# Altium project Sensor_Box_CAN_Switch.PrjPCB
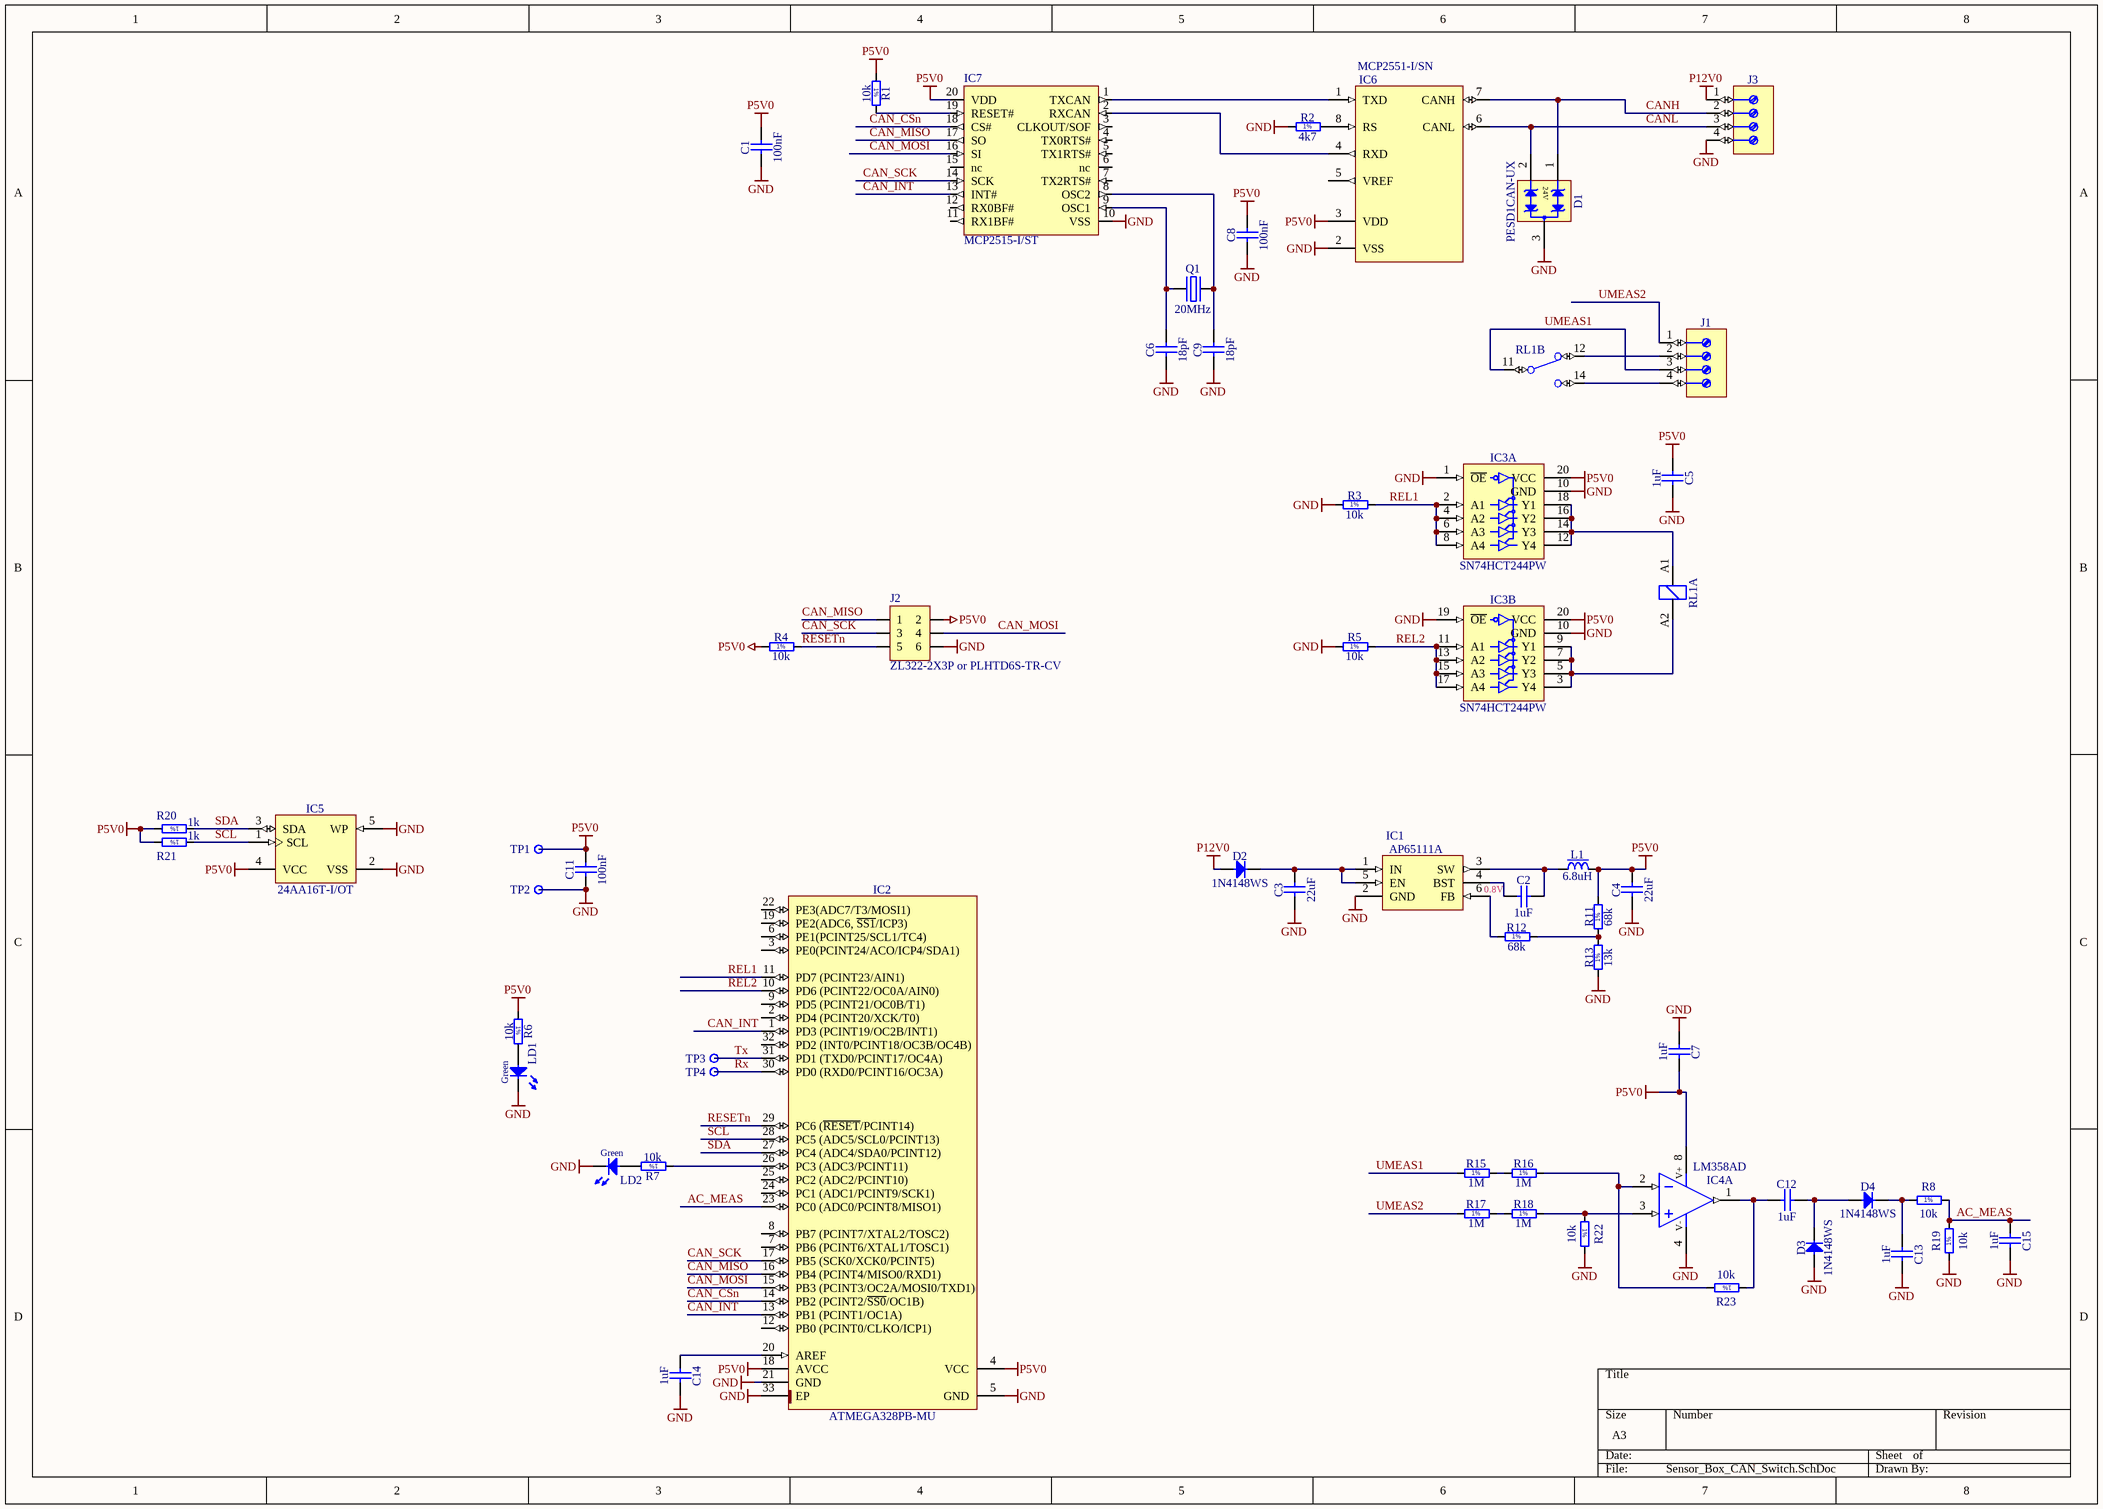
[diagram p0: Sensor_Box_CAN_Switch.SchDoc]
1 sheet, 57 parts. Net scope: global (net labels, ports and power ports of the same name join across sheets).
Board file: Sensor_Box_CAN_Switch.PCBDOC

## Sheet Sensor_Box_CAN_Switch.SchDoc
size A3

### Parts
C1  100nF  [CAPC1005X55N]
C2  1uF  [CAPC1608X87N]
C3  22uF  [CAPC1709X100N]
C4  22uF  [CAPC1709X100N]
C5  1uF  [CAPC1005X55N]
C6  18pF  [CAPC1005X55N]
C7  1uF  [CAPC1005X55N]
C8  100nF  [CAPC1005X55N]
C9  18pF  [CAPC1005X55N]
C11  100nF  [CAPC1005X55N]
C12  1uF  [CAPC1005X55N]
C13  1uF  [CAPC1005X55N]
C14  1uF  [CAPC1005X55N]
C15  1uF  [CAPC1005X55N]
D1  PESD1CAN-UX  [SOT95P237X112-3N]
D2  1N4148WS  [SODFL2512X100N]
D3  1N4148WS  [SODFL2512X100N]
D4  1N4148WS  [SODFL2512X100N]
IC1  AP65111A  [SOT95P285X110-6N]
IC2  ATMEGA328PB-MU  [QFN50P500X500X100-33N-S325]
IC3  SN74HCT244PW  [SOP65P640X120-20N]  (parts A,B of 2)
IC4  LM358AD  [SOIC127P600X175-8N]  (part A of 2)
IC5  24AA16T-I/OT  [SOT95P280X145-5N]
IC6  MCP2551-I/SN  [SOIC127P600X175-8N]
IC7  MCP2515-I/ST  [SOP65P640X110-20N]
J1  (no value)  [TYCO_282836-4]
J2  ZL322-2X3P or PLHTD6S-TR-CV  [ZL322-2X3P]
J3  (no value)  [PHOENIX_1725672]
L1  6.8uH  [IND_WALSIN_WLPN3030]
LD1  Green  [LED_KINGBRIGHT_KPH-1608CGCK]
LD2  Green  [LED_KINGBRIGHT_KPH-1608CGCK]
Q1  20MHz  [XTAL1160X490X430]
R1  10k  [RESC1005X40N]
R2  4k7  [RESC1005X40N]
R3  10k  [RESC1005X40N]
R4  10k  [RESC1005X40N]
R5  10k  [RESC1005X40N]
R6  10k  [RESC1005X40N]
R7  10k  [RESC1005X40N]
R8  10k  [RESC1005X40N]
R11  68k  [RESC1005X40N]
R12  68k  [RESC1005X40N]
R13  13k  [RESC1005X40N]
R15  1M  [RESC3216X65N]
R16  1M  [RESC3216X65N]
R17  1M  [RESC3216X65N]
R18  1M  [RESC3216X65N]
R19  10k  [RESC1005X40N]
R20  1k  [RESC1005X40N]
R21  1k  [RESC1005X40N]
R22  10k  [RESC1005X40N]
R23  10k  [RESC1005X40N]
RL1  REL_TYCO_SCHRACK_PE014F05  [REL_TYCO_SCHRACK_PE]  (value not drawn)  (parts A,B of 2)
TP1  Test Point  [TPS127]  (value not drawn)
TP2  Test Point  [TPS127]  (value not drawn)
TP3  Test Point  [TPS127]  (value not drawn)
TP4  Test Point  [TPS127]  (value not drawn)

### Nets
GND: C1.1 C3.1 C4.1 C5.2 C6.1 C7.1 C8.1 C9.1 C11.1 C13.2 C14.2 C15.2 D1.3(GND) D3.2(A) IC1.2(GND) IC2.5(GND) IC2.21(GND) IC2.33(EP) IC3.1(~{OE}) IC3.10(GND) IC3.19(~{OE}) IC4.4(V-) IC5.2(VSS) IC5.5(WP) IC6.2(VSS) IC7.10(VSS) J2.6 J3.4 LD1.1(C) LD2.1(C) R2.1 R3.1 R5.1 R13.1 R19.1 R22.2 TP2.1
P5V0: C1.2 C4.2 C5.1 C7.2 C8.2 C11.2 IC2.4(VCC) IC2.18(AVCC) IC3.20(VCC) IC4.8(V+) IC5.4(VCC) IC6.3(VDD) IC7.20(VDD) J2.2 L1.2 R1.1 R4.1 R6.1 R11.2 R20.2 R21.2 TP1.1
P12V0: D2.2(A) J3.1
AC_MEAS: C15.1 IC2.23(PC0_(ADC0/PCINT8/MISO1)) R8.2 R19.2
CAN_CSn: IC2.14(PB2_(PCINT2/~{SS0}/OC1B)) IC7.18(CS#)
CAN_INT: IC2.1(PD3_(PCINT19/OC2B/INT1)) IC2.13(PB1_(PCINT1/OC1A)) IC7.13(INT#)
CAN_MISO: IC2.16(PB4_(PCINT4/MISO0/RXD1)) IC7.17(SO) J2.1
CAN_MOSI: IC2.15(PB3_(PCINT3/OC2A/MOSI0/TXD1)) IC7.16(SI) J2.4
CAN_SCK: IC2.17(PB5_(SCK0/XCK0/PCINT5)) IC7.14(SCK) J2.3
CANH: D1.1(I/O1) IC6.7(CANH) J3.2
CANL: D1.2(I/O2) IC6.6(CANL) J3.3
REL1: IC2.11(PD7_(PCINT23/AIN1)) IC3.2(A1) IC3.4(A2) IC3.6(A3) IC3.8(A4) R3.2
REL2: IC2.10(PD6_(PCINT22/OC0A/AIN0)) IC3.11(A1) IC3.13(A2) IC3.15(A3) IC3.17(A4) R5.2
RESETn: IC2.29(PC6_(~{RESET}/PCINT14)) J2.5 R4.2
Rx: IC2.30(PD0_(RXD0/PCINT16/OC3A)) TP4.1
SCL: IC2.28(PC5_(ADC5/SCL0/PCINT13)) IC5.1(SCL) R21.1
SDA: IC2.27(PC4_(ADC4/SDA0/PCINT12)) IC5.3(SDA) R20.1
Tx: IC2.31(PD1_(TXD0/PCINT17/OC4A)) TP3.1
UMEAS1: J1.3 R15.1 RL1.11(C)
UMEAS2: J1.1 R17.1
NetC2_1: C2.1 IC1.4(BST)
NetC2_2: C2.2 IC1.3(SW) L1.1
NetC3_2: C3.2 D2.1(C) IC1.1(IN) IC1.5(EN)
NetC6_2: C6.2 IC7.9(OSC1) Q1.1(OSC1)
NetC9_2: C9.2 IC7.8(OSC2) Q1.2(OSC2)
NetC12_1: C12.1 IC4.1(OUT) R23.1
NetC12_2: C12.2 D3.1(C) D4.2(A)
NetC13_1: C13.1 D4.1(C) R8.1
NetC14_1: C14.1 IC2.20(AREF)
NetIC1_6: IC1.6(FB) R12.1
NetIC2_26: IC2.26(PC3_(ADC3/PCINT11)) R7.1
NetIC3_3: IC3.3(Y4) IC3.5(Y3) IC3.7(Y2) IC3.9(Y1) RL1.A2
NetIC3_12: IC3.12(Y4) IC3.14(Y3) IC3.16(Y2) IC3.18(Y1) RL1.A1
NetIC4_2: IC4.2(IN-) R16.2 R23.2
NetIC4_3: IC4.3(IN+) R18.2 R22.1
NetIC6_1: IC6.1(TXD) IC7.1(TXCAN)
NetIC6_4: IC6.4(RXD) IC7.2(RXCAN)
NetIC6_8: IC6.8(RS) R2.2
NetIC7_19: IC7.19(RESET#) R1.2
NetJ1_2: J1.2 RL1.12(NC)
NetJ1_4: J1.4 RL1.14(NO)
NetLD1_2: LD1.2(A) R6.2
NetLD2_2: LD2.2(A) R7.2
NetR11_1: R11.1 R12.2 R13.2
NetR15_2: R15.2 R16.1
NetR17_2: R17.2 R18.1

Not connected (* = marked no-connect by the designer): IC2 2(PD4_(PCINT20/XCK/T0)) 3(PE0(PCINT24/ACO/ICP4/SDA1)) 6(PE1(PCINT25/SCL1/TC4)) 7(PB6_(PCINT6/XTAL1/TOSC1)) 8(PB7_(PCINT7/XTAL2/TOSC2)) 9(PD5_(PCINT21/OC0B/T1)) 12(PB0_(PCINT0/CLKO/ICP1)) 19(PE2(ADC6,_~{SS1}/ICP3)) 22(PE3(ADC7/T3/MOSI1)) 24(PC1_(ADC1/PCINT9/SCK1)) 25(PC2_(ADC2/PCINT10)) 32(PD2_(INT0/PCINT18/OC3B/OC4B)); IC6 5(VREF); IC7 3(CLKOUT/SOF) 4(TX0RTS#) 5(TX1RTS#) 6(nc) 7(TX2RTS#) 11(RX1BF#) 12(RX0BF#) 15(nc)

### Notes on the sheet
- 0.8V
- (in symbol R0402_1K_1%_0.0625W_100PPM) 1%
- (in symbol R0402_4K7_1%_0.0625W_100PPM) 1%
- (in symbol R0402_10K_1%_0.0625W_100PPM) 1%
- (in symbol R0402_13K_1%_0.0625W_100PPM) 1%
- (in symbol R0402_68K_1%_0.0625W_100PPM) 1%
- (in symbol R1206_1M_1%_0.25W_100PPM) 1%

### Library data of the parts
C1 C8 C11 = CC0402_100NF_16V_10%_X5R: Non-polarised capacitor; Part Description: SMD Multilayer Chip Ceramic Capacitor; Manufacturer: GENERIC; Manufacturer1 Part Number: GRM155R61C104KA88D; Voltage: 16V; TC: X5R; Tolerance: ±10%; Part Number: CC0402_100NF_16V_10%_X5R; Component Kind: Standard; Component Type: Standard; Pin Count: 2; Value: 100nF; Status: None; Manufacturer Part Number: CC0402_100NF_16V_10%_X5R; Case: 0402; Mounted: Yes; Socket: No; SMD: Yes; Sense: No; Manufacturer1 Example: MURATA; Manufacturer1 ComponentHeight: 0.55mm; HelpURL: \\cern.ch\dfs\Applications\Altium\Datasheets\CC0402_X5R_MURATA_GRM.pdf; Author: CERN DEM JLC; CreateDate: 10.12.2013; LatestRevisionDate: 10.12.2013
C2 = CC0603_1UF_16V_10%_X7R: Non-polarised capacitor; Part Description: SMD Multilayer Chip Ceramic Capacitor; Manufacturer: GENERIC; Manufacturer1 Part Number: 223878615663; Voltage: 16V; TC: X7R; Tolerance: ±10%; Part Number: CC0603_1UF_16V_10%_X7R; Component Kind: Standard; Component Type: Standard; Pin Count: 2; Value: 1uF; Status: None; Manufacturer Part Number: CC0603_1uF_16V_10%_X7R; Case: 0603; Mounted: Yes; Socket: No; SMD: Yes; Sense: No; Manufacturer1 Example: YAGEO PHYCOMP; Manufacturer1 ComponentHeight: 0.9mm; HelpURL: \\cern.ch\dfs\Applications\Altium\Datasheets\CC0603_X7R_PHYCOMP.pdf; Author: CERN DEM JLC; CreateDate: 03.12.2007; LatestRevisionDate: 17.04.2015
C3 C4 = CC0603_22UF_6.3V_20%_X5R: Non-polarised capacitor; Part Description: SMD Multilayer Chip Ceramic Capacitor; Manufacturer: GENERIC; Manufacturer1 Part Number: C1608X5R0J226M080AC; Voltage: 6.3V; TC: X5R; Tolerance: ±20%; Part Number: CC0603_22UF_6.3V_20%_X5R; Component Kind: Standard; Component Type: Standard; Pin Count: 2; Value: 22uF; Status: None; Manufacturer Part Number: CC0603_22UF_6.3V_20%_X5R; Case: 0603; Mounted: Yes; Socket: No; SMD: Yes; Sense: No; Manufacturer1 Example: TDK; Manufacturer1 ComponentHeight: 1mm; HelpURL: \\cern.ch\dfs\Applications\Altium\Datasheets\CC0603_X5R_TDK_C.pdf; Author: CERN DEM JLC; CreateDate: 16.12.2013; LatestRevisionDate: 13.09.2016
C5 C7 C12-C15 = CC0402_1UF_16V_10%_X5R: Non-polarised capacitor; Part Description: SMD Multilayer Chip Ceramic Capacitor; Manufacturer: GENERIC; Manufacturer1 Part Number: C1005X5R1C105KT; Voltage: 16V; TC: X5R; Tolerance: ±10%; Part Number: CC0402_1UF_16V_10%_X5R; Component Kind: Standard; Component Type: Standard; Pin Count: 2; Value: 1uF; Status: Preferred; Manufacturer Part Number: CC0402_1UF_16V_10%_X5R; Case: 0402; Mounted: Yes; Socket: No; SMD: Yes; Sense: No; Manufacturer1 Example: TDK; Manufacturer1 ComponentHeight: 0.55mm; HelpURL: \\cern.ch\dfs\Applications\Altium\Datasheets\CC0402_X5R_TDK_C.pdf; Author: CERN DEM JLC; CreateDate: 25.10.2012; LatestRevisionDate: 25.10.2012
C6 C9 = CC0402_18PF_50V_5%_C0G: Non-polarised capacitor; Part Description: SMD Multilayer Chip Ceramic Capacitor; Manufacturer: GENERIC; Manufacturer1 Part Number: C0402C180J5GACTU; Voltage: 50V; TC: C0G/NP0; Tolerance: ±5%; Part Number: CC0402_18PF_50V_5%_C0G; Component Kind: Standard; Component Type: Standard; Pin Count: 2; Value: 18pF; Status: Preferred; Manufacturer Part Number: CC0402_18PF_50V_5%_C0G; Case: 0402; Mounted: Yes; Socket: No; SMD: Yes; Sense: No; Manufacturer1 Example: KEMET; Manufacturer1 ComponentHeight: 0.55mm; HelpURL: \\cern.ch\dfs\Applications\Altium\Datasheets\CC0805_C0G_KEMET_(Commercial Grade).pdf; Author: CERN DEM JLC; CreateDate: 04.10.2016; LatestRevisionDate: 04.10.2016
D1 = D_TVS_PESD1CAN: TVS Diode for CAN; Manufacturer: Nexperia; Voltage: 24V; Power: 400W; PressFit: No; Bonding: No; Part Number: PESD1CAN-UX; Component Kind: Standard; Component Type: Standard; Device: PESD1CAN-UX; PackageDescription: SOT, 0.95mm, pitch; 3 pin,1.30mm W X 2.92mm L X 1.12mm H body, IPC Medium Density; Part Description: TVS Diode for CAN; Manufacturer Part Number: PESD1CAN-UX; Pin Count: 3; Case: SOT-23; Mounted: Yes; Socket: No; SMD: Yes; Sense: No; ComponentHeight: 1.12mm; HelpURL: \\cern.ch\dfs\Applications\Altium\Datasheets\SM712.TCT.pdf; Author: CERN DEM JLC; CreateDate: 03.09.2014; LatestRevisionDate: 13.01.2015
D2-D4 = 1N4148WS: Diode; Part Description: Small Signal Diodes; Manufacturer: FAIRCHILD SEMICONDUCTOR; Voltage: 75V; Power: 150mA; PressFit: No; Bonding: No; Part Number: 1N4148WS; Component Kind: Standard; Component Type: Standard; Device: 1N4148WS; PackageDescription: SODFL Diode; 1.70mm W X 1.25mm L X 1.00mm H body, IPC Medium Density; Manufacturer Part Number: 1N4148WS; Pin Count: 2; Case: SOD-323F; Mounted: Yes; Socket: No; SMD: Yes; Sense: No; ComponentHeight: 1mm; HelpURL: \\cern.ch\dfs\Applications\Altium\Datasheets\1N4148WS.pdf; Author: CERN DEM JLC; CreateDate: 12.05.2011; LatestRevisionDate: 12.05.2011
IC1 = PM_AP65111A: LIGHT LOAD IMPROVED 1.5A SYNCH DC/DC BUCK CONVERTER; Manufacturer: DIODES INCORPORATED; PressFit: No; Bonding: No; Part Number: AP65111A; Component Kind: Standard; Component Type: Standard; Device: AP65111A; PackageDescription: SOT23, 0.95mm pitch; 6 pin, 1.6mm W X 3.0mm L X 1.45mm H body, IPC Medium Density; Part Description: LIGHT LOAD IMPROVED 1.5A SYNCH DC/DC BUCK CONVERTER; Manufacturer Part Number: AP65111A; Pin Count: 5; Case: SOT26; Mounted: Yes; Socket: No; SMD: Yes; Sense: No; ComponentHeight: 1.45mm; HelpURL: \\cern.ch\dfs\Applications\Altium\Datasheets\AP133-WG-7.pdf; Author: GK; CreateDate: 10.07.2015; LatestRevisionDate: 10.07.2015
IC2 = UPC_ATMEGA328PB-MU: 8-bit AVR 20MHz Microcontroller With 32K Bytes In-System  Programmable  Flash; Part Description: 8-bit AVR Microcontroller, 32KB Flash, 1KB EEPROM, 2KB SRAM, 32-pin MLF, Industrial Grade (-40°C to 85°C); Manufacturer: ATMEL; PressFit: No; Bonding: No; Part Number: ATMEGA328PB-MU; Component Kind: Standard; Component Type: Standard; Device: ATMEGA328PB-MU; PackageDescription: QFN, (MO-220-VHHD-2) 0.50mm pitch,square; 8 pin X 8 pin, 5mm X 5mm X 1.00mm H body (w/thermal tab 3.25 X 3.25mm),  IPC Medium Density; Manufacturer Part Number: ATMEGA328PB-MU; Pin Count: 33; Case: QFN32; Mounted: Yes; Socket: No; SMD: Yes; Sense: No; ComponentHeight: 1mm; HelpURL: \\cern.ch\dfs\Applications\Altium\Datasheets\ATMEGA328P-MU.pdf; Author: GK; CreateDate: 2011-02-08; LatestRevisionDate: 2014-07-02
IC3 = SN74HCT244PW: Octal Buffer/Driver with 3-State Ouputs; Part Description: Octal Buffer And Line Driver with 3-State Ouputs; Manufacturer: TEXAS INSTRUMENTS; PressFit: No; Bonding: No; Part Number: SN74HCT244PW; Component Kind: Standard; Component Type: Standard; Device: SN74HCT244PW; PackageDescription: SOP, 20-Leads, Body 6.5x4.4mm, Pitch 0.65mm, IPC Medium Density; Manufacturer Part Number: SN74HCT244PW; Pin Count: 20; Case: TSSOP20; Mounted: Yes; Socket: No; SMD: Yes; Sense: No; ComponentHeight: 1.2mm; Author: CERN DEM JLC; HelpURL: \\cern.ch\dfs\Applications\Altium\Datasheets\SN74HCT244PW.pdf; CreateDate: 11.10.2011; LatestRevisionDate: 11.10.2011
IC4 = LM358AD: Dual Operational Amplifier; Manufacturer: TEXAS INSTRUMENTS; PressFit: No; Bonding: No; Part Number: LM358AD; Component Kind: Standard; Component Type: Standard; Device: LM358AD; PackageDescription: SOIC 8, Pitch 1.27mm - Body 4x5mm, IPC Medium Density; Part Description: Dual Operational Amplifier; Manufacturer Part Number: LM358AD; Pin Count: 8; Case: SOIC8; Mounted: Yes; Socket: No; SMD: Yes; Sense: No; ComponentHeight: 1.75mm; Author: CERN DEM JLC; HelpURL: \\cern.ch\dfs\Applications\Altium\Datasheets\LM358AD.pdf; CreateDate: 02.12.2008; LatestRevisionDate: 13.04.2010
IC5 = MEM_24AA16T_SOT23: 1.7V-5.5V, 2K I2C Serial EEPROM With EUI-48 Node Identity; Part Description: 1.7V-5.5V, 16K I2C Serial EEPROM; Manufacturer: MICROCHIP TECHNOLOGY; PressFit: No; Bonding: No; Part Number: 24AA16T-I/OT; Component Kind: Standard; Component Type: Standard; Device: 24AA16T-I/OT; PackageDescription: SOT, 0.95mm pitch; 5 pin, 1.60mm W X 2.90mm L X 1.45mm H body, IPC Medium Density; Manufacturer Part Number: 24AA16T-I/OT; Pin Count: 5; Case: SOT23-5; Mounted: Yes; Socket: No; SMD: Yes; Sense: No; ComponentHeight: 1.45mm; HelpURL: \\cern.ch\dfs\Applications\Altium\Datasheets\24AA02E48T-I-OT.pdf; Author: GK; CreateDate: 31.03.2016; LatestRevisionDate: 31.03.2016
IC6 = IFC_MCP2551: High-Speed CAN Transceiver, 8-Pin SOIC, Industrial Temperature; Manufacturer: MICROCHIP TECHNOLOGY; PressFit: No; Bonding: No; Part Number: MCP2551-I/SN; Component Kind: Standard; Component Type: Standard; Device: MCP2551-I/SN; PackageDescription: SOIC 8, Pitch 1.27mm - Body 4x5mm, IPC Medium Density; Part Description: High-Speed CAN Transceiver; Manufacturer Part Number: MCP2551-I/SN; Pin Count: 8; Case: SOIC8; Mounted: Yes; Socket: No; SMD: Yes; Sense: No; ComponentHeight: 1.75mm; Author: GK; CreateDate: 07.09.2016; LatestRevisionDate: 07.09.2016
IC7 = IFC_MCP2515_TSSOP: CAN Controller With SPI nterface; Manufacturer: Microchip; Manufacturer Part Number: MCP2515T-I/ST; Part Description: Stand-Alone CAN Controller with SPI Interface; Case: TSSOP20; Component Type: Standard; Device: MCP2515; Mounted: Yes; PackageDescription: TSSOP 20, Pitch 0.65mm - Body 4.5x6.5mm, IPC Medium Density; Part Number: MCP2515T-I/ST; Pin Count: 20; SMD: Yes
J1 = TYCO_282836-4: Terminal Block, 4 Positions, Screw Connection; Part Description: 15.5A, 300V, Terminal Block, Pitch 5mm, 4 Positions, Screw Connection; Manufacturer: TYCO ELECTRONICS; PressFit: No; Part Number: TYCO_282836-4; Component Kind: Standard; Component Type: Standard; Pin Count: 4; Mounted: Yes; Socket: No; SMD: No; Sense: No; Status: None; Manufacturer Part Number: 282836-4; ComponentHeight: 10mm; HelpURL: \\cern.ch\dfs\Applications\Altium\Datasheets\TYCO_282836-4.pdf; Author: CERN DEM JLC; CreateDate: 10.11.2014; LatestRevisionDate: 10.11.2014
J2 = CON_2x3 1.27 SMT Male: 1.27 mm dual row goldpin (Maritex)
J3 = PHOENIX_1725672: Terminal Block, 4 Positions, Screw Connection; Part Description: 6A, 63V, Terminal Block, Pitch 2.54mm, 4 Positions, Screw Connection; Manufacturer: PHOENIX CONTACT; Manufacturer Part Number: 1725672 (MPT 0,5/4-2,54); PressFit: No; Part Number: PHOENIX_1725672; Component Kind: Standard; Component Type: Standard; Pin Count: 4; Mounted: Yes; Socket: No; SMD: No; Sense: No; Status: None; ComponentHeight: 8.5mm; HelpURL: \\cern.ch\dfs\Applications\Altium\Datasheets\PHOENIX_1725672.pdf; Author: CERN DEM JMW; CreateDate: 07.11.2008; LatestRevisionDate: 26.04.2010
L1 = IND_WLPN3030: 6,8uH; 900mA; 0,211Ω; 3x3x1,5mm; Part Number: IND_6.8UH_20%_WALSIN_WLPN303015M6R8PB; Part Description: Miniature Surface Mount Power Inductor (8200 Series); Manufacturer: WALSIN; Manufacturer Part Number: WLPN303015M6R8PB; Resistance: 0.21R; Tolerance: ±20%; Component Kind: Standard; Component Type: Standard; Pin Count: 2; Value: 6.8uH; Status: None; Power: 900mA; Mounted: Yes; Socket: No; SMD: Yes; Sense: No; ComponentHeight: 1.5; HelpURL: \\cern.ch\dfs\Applications\Altium\Datasheets\IND_MURATA-PS_8200.pdf; Author: GK; CreateDate: 11.07.2016; LatestRevisionDate: 11.07.2016
LD1 LD2 = LED_KINGBRIGHT_KPH-1608CGCK: LED Green 1C 2A; Part Description: SMD Green LED, Case 1.6mmX0.8mm(0603), 0.65mm Thickness; PressFit: No; Bonding: No; Part Number: LED_KINGBRIGHT_KPH-1608CGCK; Component Kind: Standard; Component Type: Standard; Color: Green; PackageDescription: SMT Green LED, Case 0603, Body L 1.6 x W 0.8mm H 0.65mm; Manufacturer: KINGBRIGHT; Manufacturer Part Number: KPH-1608CGCK; Pin Count: 2; Mounted: Yes; Socket: No; SMD: Yes; Sense: No; ComponentHeight: 0.65mm; HelpURL: \\cern.ch\dfs\Applications\Altium\Datasheets\LED_KINGBRIGHT_KPH-1608CGCK.pdf; Author: CERN DEM JLC; CreateDate: 03.07.2017; LatestRevisionDate: 03.07.2017
Q1 = X_CRYSTAL_20M_HC49: Quartz Crystal 20MHz, 30ppm, 20pF; Part Number: SR PASSIVES 20M-49SMD-SR; Part Description: Tolerance:± 30ppm, Stability:± 50ppm, -10°C to +60°C, 20pF, Surface Mount Quartz Crystal, HC49/4HSMX Series; Manufacturer: SR PASSIVES; Manufacturer Part Number: 20M-49SMD-SR; PressFit: No; Bonding: No; Component Kind: Standard; Component Type: Standard; PackageDescription: HC49/4H SMX Case, SMD Cristal, Body 11.6x4.9mm; Value: 20MHz; Pin Count: 2; Mounted: Yes; Socket: No; SMD: Yes; Sense: No; ComponentHeight: 4.3mm; HelpURL: \\cern.ch\dfs\Applications\Altium\Datasheets\XTAL_IQD_LFXTAL003166.pdf; Author: GK; CreateDate: 19.04.2012; LatestRevisionDate: 07.11.2016
R1 R3-R7 = R0402_10K_1%_0.0625W_100PPM: Resistor - 1%; Part Description: General Purpose Thick Film Chip Resistor; Manufacturer: GENERIC; Manufacturer1 Part Number: 232270671003L; TC: ±100ppm/°C; PressFit: No; Part Number: R0402_10K_1%_0.0625W_100PPM; Component Kind: Standard; Component Type: Standard; Pin Count: 2; Value: 10k; Status: Not Recommended; Power: 0.0625W; Tolerance: ±1%; Manufacturer Part Number: R0402_10K_1%_0.0625W_100PPM; Case: 0402; Mounted: Yes; Sense: No; Socket: No; SMD: Yes; Manufacturer1 Example: YAGEO PHYCOMP; Manufacturer1 ComponentHeight: 0.4mm; HelpURL: \\cern.ch\dfs\Applications\Altium\Datasheets\R0402_Phycomp_RC0402.pdf; Author: CERN DEM JLC; CreateDate: 03.12.2007; LatestRevisionDate: 17.10.2012
R2 = R0402_4K7_1%_0.0625W_100PPM: Resistor - 1%; Part Description: General Purpose Thick Film Chip Resistor; Manufacturer: GENERIC; Manufacturer1 Part Number: 232270674702L; TC: ±100ppm/°C; PressFit: No; Part Number: R0402_4K7_1%_0.0625W_100PPM; Component Kind: Standard; Component Type: Standard; Pin Count: 2; Value: 4k7; Status: Not Recommended; Power: 0.0625W; Tolerance: ±1%; Manufacturer Part Number: R0402_4K7_1%_0.0625W_100PPM; Case: 0402; Mounted: Yes; Sense: No; Socket: No; SMD: Yes; Manufacturer1 Example: YAGEO PHYCOMP; Manufacturer1 ComponentHeight: 0.4mm; HelpURL: \\cern.ch\dfs\Applications\Altium\Datasheets\R0402_Phycomp_RC0402.pdf; Author: CERN DEM JLC; CreateDate: 03.12.2007; LatestRevisionDate: 17.10.2012
R8 R19 R22 R23 = R0402_10K_1%_0.0625W_100PPM: Resistor - 1%; Part Description: General Purpose Thick Film Chip Resistor; Manufacturer: GENERIC; Manufacturer1 Part Number: 232270671003L; TC: ±100ppm/°C; Table: Resistors SMD; Part Number: R0402_10K_1%_0.0625W_100PPM; Component Kind: Standard; Component Type: Standard; Pin Count: 2; Value: 10k; Status: Not recommended; Power: 0.0625W; Tolerance: ±1%; Manufacturer Part Number: R0402_10K_1%_0.0625W_100PPM; Case: 0402; Mounted: Yes; Socket: No; SMD: Yes; Manufacturer1 Example: YAGEO PHYCOMP; Manufacturer1 ComponentHeight: 0.4mm; HelpURL: \\cern.ch\dfs\Applications\Altium\Datasheets\R0402_Phycomp_RC0402.pdf; Author: CERN DEM JLC; CreateDate: 2007-12-03; LatestRevisionDate: 2012-10-17
R11 R12 = R0402_68K_1%_0.0625W_100PPM: Resistor - 1%; Part Description: General Purpose Thick Film Chip Resistor; Manufacturer: GENERIC; Manufacturer1 Part Number: 232270676803L; TC: ±100ppm/°C; PressFit: No; Part Number: R0402_68K_1%_0.0625W_100PPM; Component Kind: Standard; Component Type: Standard; Pin Count: 2; Value: 68k; Status: Not Recommended; Power: 0.0625W; Tolerance: ±1%; Manufacturer Part Number: R0402_68K_1%_0.0625W_100PPM; Case: 0402; Mounted: Yes; Sense: No; Socket: No; SMD: Yes; Manufacturer1 Example: YAGEO PHYCOMP; Manufacturer1 ComponentHeight: 0.4mm; HelpURL: \\cern.ch\dfs\Applications\Altium\Datasheets\R0402_Phycomp_RC0402.pdf; Author: CERN DEM JLC; CreateDate: 03.12.2007; LatestRevisionDate: 17.10.2012
R13 = R0402_13K_1%_0.0625W_100PPM: Resistor - 1%; Part Description: General Purpose Thick Film Chip Resistor; Manufacturer: GENERIC; Manufacturer1 Part Number: 232270671303L; TC: ±100ppm/°C; PressFit: No; Part Number: R0402_13K_1%_0.0625W_100PPM; Component Kind: Standard; Component Type: Standard; Pin Count: 2; Value: 13k; Status: Not Recommended; Power: 0.0625W; Tolerance: ±1%; Manufacturer Part Number: R0402_13K_1%_0.0625W_100PPM; Case: 0402; Mounted: Yes; Sense: No; Socket: No; SMD: Yes; Manufacturer1 Example: YAGEO PHYCOMP; Manufacturer1 ComponentHeight: 0.4mm; HelpURL: \\cern.ch\dfs\Applications\Altium\Datasheets\R0402_Phycomp_RC0402.pdf; Author: CERN DEM JLC; CreateDate: 03.12.2007; LatestRevisionDate: 17.10.2012
R15-R18 = R1206_1M_1%_0.25W_100PPM: Resistor - 1%; Part Description: General Purpose Thick Film Chip Resistor; Manufacturer: GENERIC; Manufacturer1 Part Number: NRC12F1004TRF; Power: 0.25W; TC: ±100ppm/°C; PressFit: No; Part Number: R1206_1M_1%_0.25W_100PPM; Component Kind: Standard; Component Type: Standard; Pin Count: 2; Value: 1M; Status: Preferred; Tolerance: ±1%; Manufacturer Part Number: R1206_1M_1%_0.25W_100PPM; Case: 1206; Mounted: Yes; Sense: No; Socket: No; SMD: Yes; Manufacturer1 Example: NIC COMPONENT; Manufacturer1 ComponentHeight: 0.65mm; HelpURL: \\cern.ch\dfs\Applications\Altium\Datasheets\R1206_NIC_NRC.pdf; Author: CERN DEM JLC; CreateDate: 03.12.2007; LatestRevisionDate: 13.03.2008
R20 R21 = R0402_1K_1%_0.0625W_100PPM: Resistor - 1%; Part Description: General Purpose Thick Film Chip Resistor; Manufacturer: GENERIC; Manufacturer1 Part Number: 232270671002L; TC: ±100ppm/°C; PressFit: No; Part Number: R0402_1K_1%_0.0625W_100PPM; Component Kind: Standard; Component Type: Standard; Pin Count: 2; Value: 1k; Status: Not Recommended; Power: 0.0625W; Tolerance: ±1%; Manufacturer Part Number: R0402_1K_1%_0.0625W_100PPM; Case: 0402; Mounted: Yes; Sense: No; Socket: No; SMD: Yes; Manufacturer1 Example: YAGEO PHYCOMP; Manufacturer1 ComponentHeight: 0.4mm; HelpURL: \\cern.ch\dfs\Applications\Altium\Datasheets\R0402_Phycomp_RC0402.pdf; Author: CERN DEM JLC; CreateDate: 03.12.2007; LatestRevisionDate: 17.10.2012
RL1 = REL_TYCO_SCHRACK_PE014F05: PE PCB Relay Form C (1 CO Contact), 1 Coil; Part Description: 5A SPDT Power PCB Relay PE Bistable Series; Manufacturer: TYCO SCHRACK; PressFit: No; Value: 5VDC; Part Number: REL_TYCO_SCHRACK_PE014F05; Component Kind: Standard; Component Type: Standard; Pin Count: 5; PackageDescription: 5 Leads, Row Spacing 5.12mm; Body 20mm x 10mm, TYCO PE Series; Mounted: Yes; Socket: No; SMD: No; Sense: No; Status: None; Manufacturer Part Number: PE014F05; ComponentHeight: 10mm; HelpURL: \\cern.ch\dfs\Applications\Altium\Datasheets\REL_TYCO_SCHRACK_RT314F05.pdf; Author: GK; CreateDate: 28.06.2017; LatestRevisionDate: 28.06.2017
TP1-TP4 = SMD_PAD_1.27X1.27MM: Part Description: 1.27mm x 1.27mm PCB Copper Area (SMD Test Point); Mounted: No; Part Number: SMD_PAD_1.27X1.27MM; Component Kind: Standard (No BOM); Component Type: Standard (No BOM); Pin Count: 1; Family: Test Point; Socket: No; SMD: Yes; Sense: No; Status: None; ComponentHeight: 0mm; HelpURL: Undefined; Author: CERN DEM JLC; CreateDate: 12.01.2008; LatestRevisionDate: 12.01.2008; PackageDescription: 1.27mm x 1.27mm PCB Copper Area (SMD Test Point)

## Assembly variants
SMD_DCDC: not fitted IC46 IC53